# EAGLE schematic NEW キッカー＆ボール補足 (EAGLE 9.6.2)
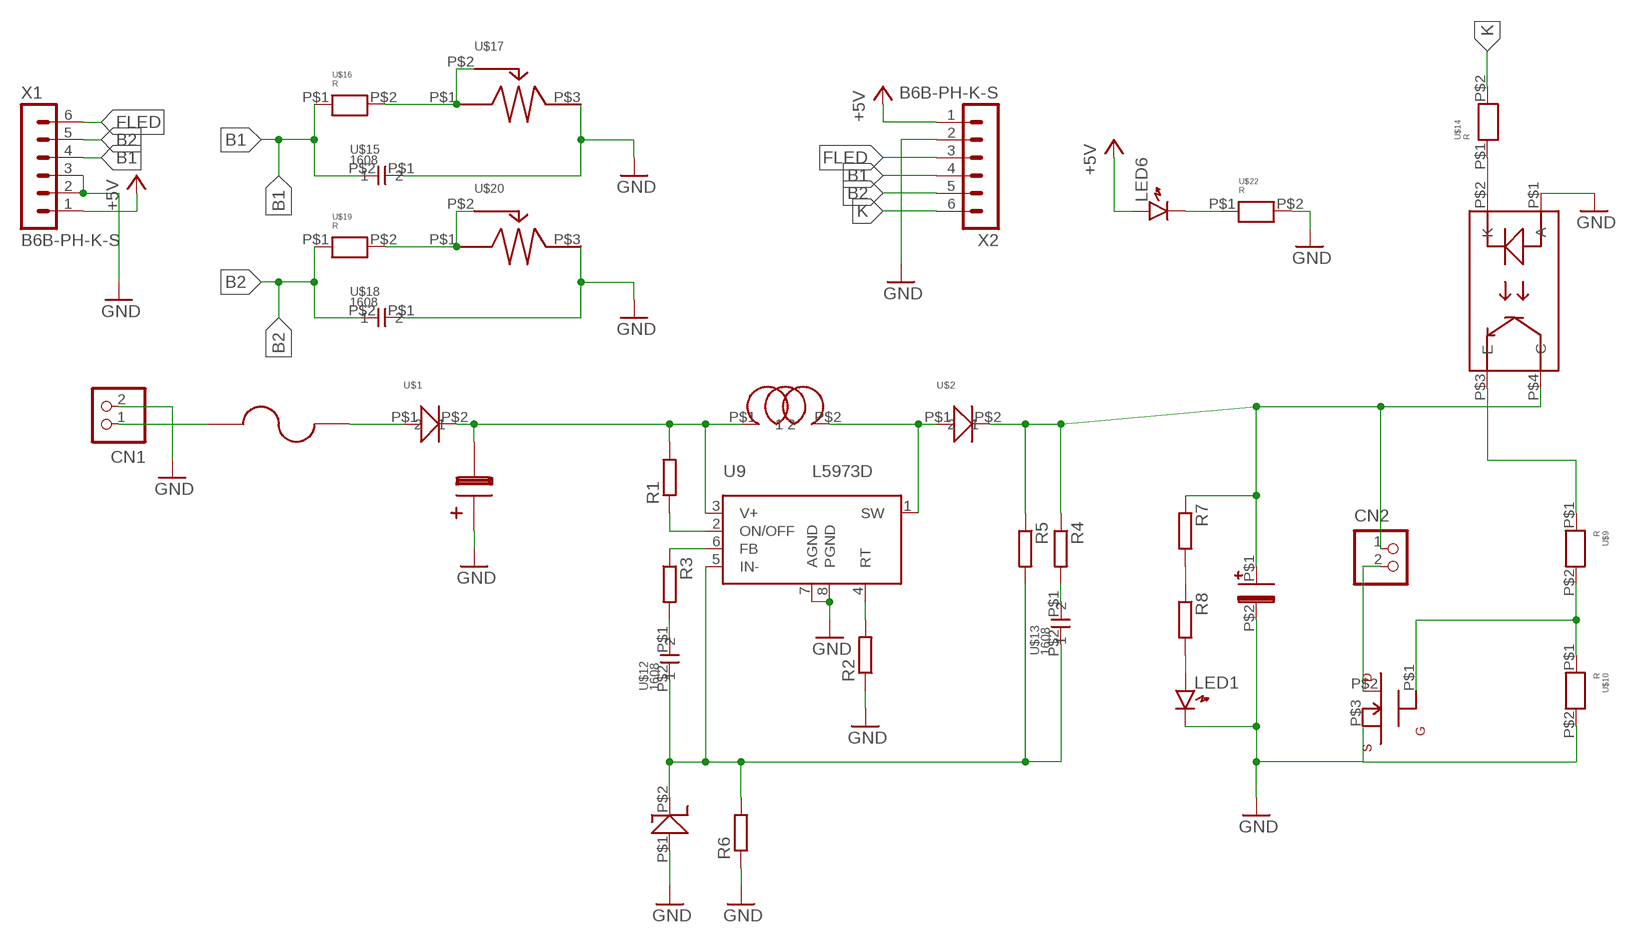
[diagram p0: schematic, sheet 1]

## Parts
CN1  B2B-XH-A  [B2B-XH-A]
CN2  B2B-XH-A  [B2B-XH-A]
LED1  LED1608  [LED1608]
LED6  LED1608  [LED1608]
R1  R-EU_0207/10  [0207/10]
R2  R-EU_0207/10  [0207/10]
R3  R-EU_0207/10  [0207/10]
R4  R-EU_0207/10  [0207/10]
R5  R-EU_0207/10  [0207/10]
R6  R-EU_0207/10  [0207/10]
R7  R-EU_0207/10  [0207/10]
R8  R-EU_0207/10  [0207/10]
U9  L5973D  [HSOP8]
U$1  D  [D]
U$2  D  [D]
U$3  FUSE3.7A  [FUSE3.7A]
U$4  I  [I]
U$5  MOS  [MOS]
U$6  PHOTOCOUPLER  [PHOTOCOUPLER]
U$7  TD  [TD]
U$8  FGFG2  [FG2]
U$9  R  [1608]
U$10  R  [1608]
U$11  10  [10]
U$12  1608  [CON]
U$13  1608  [CON]
U$14  R  [1608]
U$15  1608  [CON]
U$16  R  [1608]
U$17  VR  [VR]
U$18  1608  [CON]
U$19  R  [1608]
U$20  VR  [VR]
U$22  R  [1608]
X1  B6B-PH-K-S  [B6B-PH-K-S]
X2  B6B-PH-K-S  [B6B-PH-K-S]

## Nets
+5V: LED6.A X1.1 X2.1
B1: U$15.P$2 U$16.P$1 X1.4 X2.4
B2: U$18.P$2 U$19.P$1 X1.5 X2.5
FLED: X1.6 X2.3
GND: CN1.2 LED1.K R2.1 R6.1 U$5.P$3 U$6.P$1(A) U$7.P$1 U$8.P$2 U$10.P$2 U$11.P$1 U$15.P$1 U$17.P$3 U$18.P$1 U$20.P$3 U$22.P$2 X1.2 X1.3 X2.2
K: U$14.P$2 X2.6
N$1: CN1.1 U$3.P$1
N$2: U$1.P$1 U$3.P$2
N$3: CN2.1 R4.1 R5.1 R7.1 U$2.P$2 U$6.P$4(C) U$8.P$1
N$4: U$6.P$3(E) U$9.P$1
N$5: CN2.2 U$5.P$2
N$6: R1.1 U9.2(ON/OFF)
N$7: U$5.P$1 U$9.P$2 U$10.P$1
N$8: R1.2 U9.3(V+) U$1.P$2 U$4.P$1 U$11.P$2
N$9: R2.2 U9.4(RT)
N$10: R5.2 R6.2 U9.5(IN-) U$7.P$2 U$12.P$2 U$13.P$2
N$11: R4.2 U$13.P$1
N$12: R3.1 U9.6(FB)
N$13: R3.2 U$12.P$1
N$14: U$6.P$2(K) U$14.P$1
N$16: R7.2 R8.1
N$17: U$16.P$2 U$17.P$1 U$17.P$2
N$18: U$19.P$2 U$20.P$1 U$20.P$2
N$19: LED1.A R8.2
N$37: LED6.K U$22.P$1
PGND: U9.7(AGND) U9.8(PGND) ; supply symbol labelled GND
SW: U9.1(SW) U$2.P$1 U$4.P$2

## Power pins joined to a net without a drawn wire
GND: U9.9(GND)

## Library data of the parts
CN1 CN2 = jst-xh:B2B-XH-A: Wire-to-Board 2.5mm pitch top mount connector Source: http://www.jst-mfg.com/product/pdf/jpn/XH.pdf http://www.jst-mfg.com/product/detail.php?series=277
LED1 LED6 = generic:LED: Generic LEDs
R1-R8 = rcl:R-EU_: RESISTOR, European symbol; SPICEPREFIX: R
U9 = l5973d:L5973D: 2.5A switch step down switching regulator
U$1 U$2 = D 40V2A:D
U$3 = FUSE 3.7A:FUSE3.7A
U$4 = Inductor:I
U$5 = MOS-FET:MOS
U$6 = Photo coupler:PHOTOCOUPLER
U$7 = ZD 3.9V200mW:TD
U$8 = C FG:FG
U$9 U$10 U$14 U$16 U$19 U$22 = R 1608:R
U$11 = 10uF50V 電解:10
U$12 U$13 U$15 U$18 = con1608:1608
U$17 U$20 = VR tippu:VR
X1 X2 = con-JST PH:B6B-PH: JST PH series header 2.00mm pitch disconnectable crimp style connectors, vertical (side entry type), 6 pins